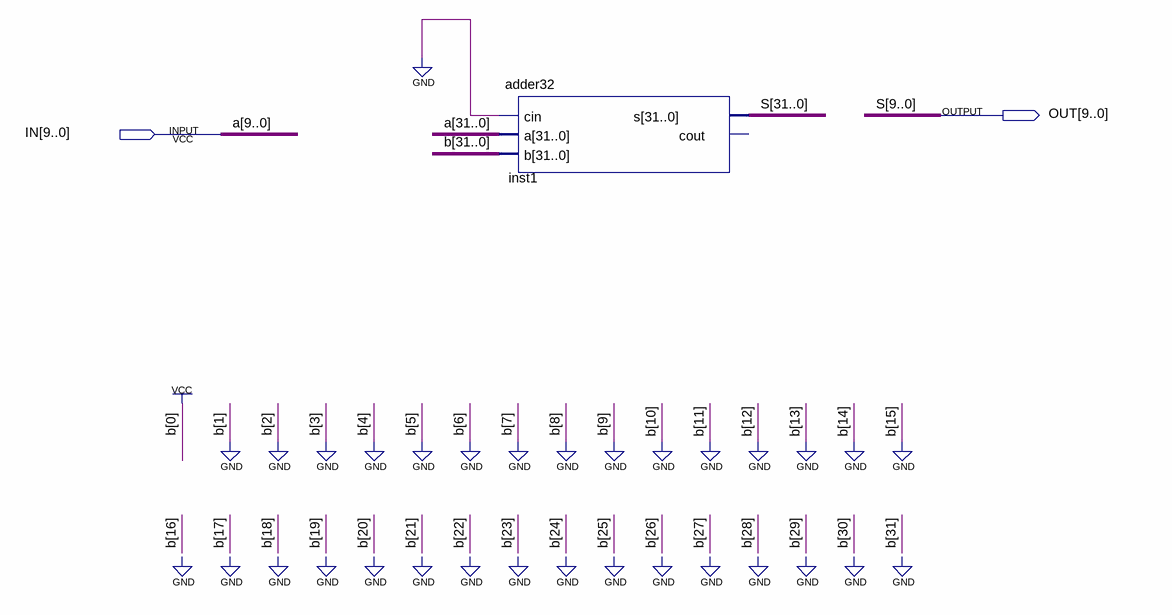
[diagram p0: schematic sheet]
// Quartus schematic incrementer10.bdf as structural Verilog: 1 symbols, 2 pins
module incrementer10 (
  input  [9:0] IN,
  output [9:0] OUT
);

  wire [31:10] a, S;
  wire [31:16] b;

  adder32 inst1 (.cin(1'b0), .a({a, IN}), .b({b, 16'b0000000000000001}), .s({S, OUT}));  // open: cout

  // Other names for the same wires on the sheet: a[9:0] = IN; S[9:0] = OUT
endmodule
